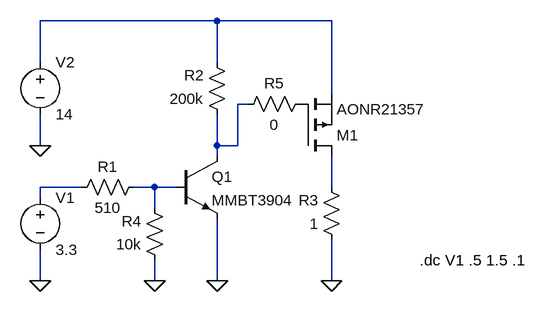
[diagram p0: schematic ltspice_batery_switch.lib.asc]
ltspice_batery_switch.lib.asc, the LTspice schematic file:
Version 4
SHEET 1 1648 680
WIRE 1008 -272 736 -272
WIRE 1184 -272 1008 -272
WIRE 736 -208 736 -272
WIRE 1008 -208 1008 -272
WIRE 1184 -160 1184 -272
WIRE 1056 -144 1040 -144
WIRE 736 -80 736 -128
WIRE 1008 -80 1008 -128
WIRE 1040 -80 1040 -144
WIRE 1040 -80 1008 -80
WIRE 1008 -64 1008 -80
WIRE 800 -16 736 -16
WIRE 912 -16 880 -16
WIRE 944 -16 912 -16
WIRE 1184 -16 1184 -64
WIRE 736 0 736 -16
WIRE 912 16 912 -16
WIRE 736 128 736 80
WIRE 912 128 912 96
WIRE 1008 128 1008 32
WIRE 1184 128 1184 64
FLAG 1008 128 0
FLAG 1184 128 0
FLAG 736 128 0
FLAG 736 -80 0
FLAG 912 128 0
SYMBOL voltage 736 -16 R0
SYMATTR InstName V1
SYMATTR Value 3.3
SYMATTR SpiceLine Rser=.001
SYMBOL pmos 1136 -64 M180
SYMATTR InstName M1
SYMATTR Value AONR21357
SYMBOL npn 944 -64 R0
SYMATTR InstName Q1
SYMATTR Value MMBT3904
SYMBOL res 896 -32 R90
WINDOW 0 0 56 VBottom 2
WINDOW 3 32 56 VTop 2
SYMATTR InstName R1
SYMATTR Value 510
SYMBOL res 1024 -112 R180
WINDOW 0 36 76 Left 2
WINDOW 3 36 40 Left 2
SYMATTR InstName R2
SYMATTR Value 200k
SYMBOL res 1200 80 R180
WINDOW 0 36 76 Left 2
WINDOW 3 36 40 Left 2
SYMATTR InstName R3
SYMATTR Value 1
SYMBOL voltage 736 -224 R0
SYMATTR InstName V2
SYMATTR Value 14
SYMATTR SpiceLine Rser=.001
SYMBOL res 928 112 R180
WINDOW 0 36 76 Left 2
WINDOW 3 36 40 Left 2
SYMATTR InstName R4
SYMATTR Value 10k
SYMBOL res 1152 -160 R90
WINDOW 0 0 56 VBottom 2
WINDOW 3 32 56 VTop 2
SYMATTR InstName R5
SYMATTR Value 0
TEXT 1320 96 Left 2 !.dc V1 .5 1.5 .1

The netlist it stands for:
* ltspice_batery_switch.lib.asc
V1 N003 0 3.3 Rser=.001
M1 N005 P001 N001 N001 AONR21357
Q1 N002 N004 0 0 MMBT3904
R1 N004 N003 510
R2 N002 N001 200k
R3 0 N005 1
V2 N001 0 14 Rser=.001
R4 0 N004 10k
R5 P001 N002 0
.model NPN NPN
.model PNP PNP
.lib standard.bjt
.model NMOS NMOS
.model PMOS PMOS
.lib standard.mos
.dc V1 .5 1.5 .1
.backanno
.end